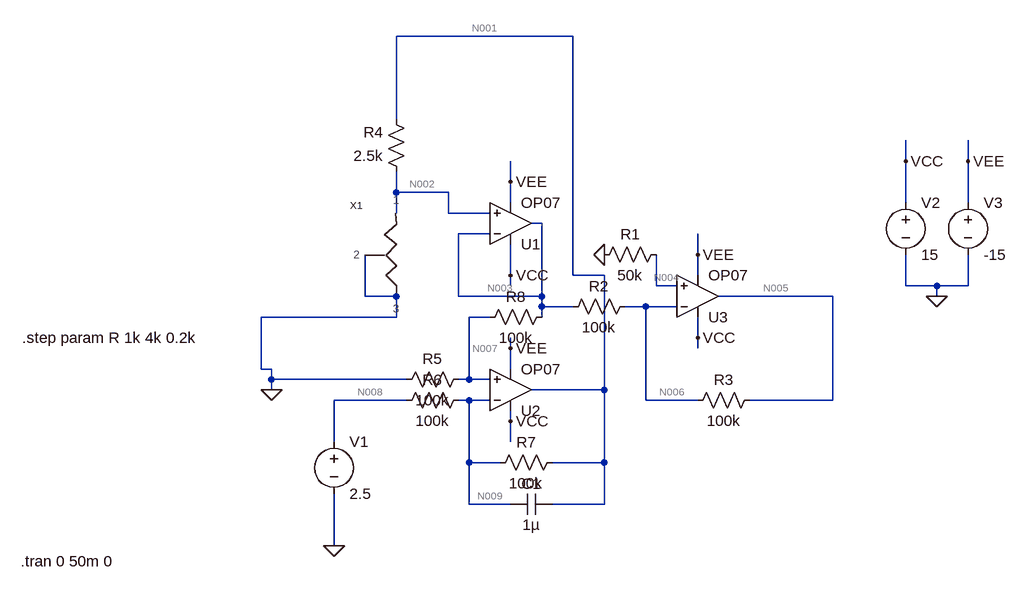
[diagram p0: schematic 2_23.asc]
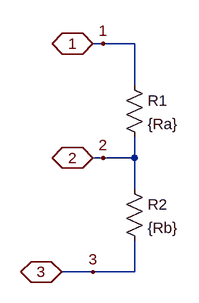
[diagram p1: sub-circuit dian_wei_qi.asc]
2_23.asc, the LTspice schematic file:
Version 4
SHEET 1 964 680
WIRE 288 -208 16 -208
WIRE 16 -80 16 -208
WIRE 800 -16 800 -48
WIRE 896 -16 896 -48
WIRE 192 16 192 -16
WIRE 16 32 16 0
WIRE 96 32 16 32
WIRE 192 48 192 16
WIRE 800 48 800 -16
WIRE 896 48 896 -16
WIRE 16 64 16 32
WIRE 96 64 96 32
WIRE 160 64 96 64
WIRE 240 80 224 80
WIRE 160 96 112 96
WIRE 480 128 480 96
WIRE 192 160 192 112
WIRE 288 160 288 -208
WIRE 336 160 288 160
WIRE 480 160 480 128
WIRE 192 176 192 160
WIRE 416 176 416 128
WIRE 448 176 416 176
WIRE 800 176 800 128
WIRE 848 176 800 176
WIRE 896 176 896 128
WIRE 896 176 848 176
WIRE -32 192 -32 128
WIRE 16 192 -32 192
WIRE 112 192 112 96
WIRE 240 192 240 80
WIRE 240 192 112 192
WIRE 688 192 512 192
WIRE 848 192 848 176
WIRE 240 208 240 192
WIRE 288 208 240 208
WIRE 400 208 368 208
WIRE 448 208 400 208
WIRE 16 224 16 192
WIRE 16 224 -192 224
WIRE 160 224 128 224
WIRE 240 224 240 208
WIRE 480 256 480 224
WIRE 192 272 192 256
WIRE 480 272 480 256
WIRE -192 304 -192 224
WIRE -176 304 -192 304
WIRE 192 304 192 272
WIRE -176 320 -176 304
WIRE 32 320 -176 320
WIRE 128 320 128 224
WIRE 128 320 112 320
WIRE 160 320 128 320
WIRE -176 336 -176 320
WIRE 336 336 336 160
WIRE 336 336 224 336
WIRE 32 352 -80 352
WIRE 128 352 112 352
WIRE 160 352 128 352
WIRE 400 352 400 208
WIRE 480 352 400 352
WIRE 688 352 688 192
WIRE 688 352 560 352
WIRE 192 384 192 368
WIRE -80 416 -80 352
WIRE 192 416 192 384
WIRE 128 448 128 352
WIRE 176 448 128 448
WIRE 336 448 336 336
WIRE 336 448 256 448
WIRE 128 512 128 448
WIRE 192 512 128 512
WIRE 336 512 336 448
WIRE 336 512 256 512
WIRE -80 576 -80 496
FLAG -176 336 0
FLAG -80 576 0
FLAG 336 128 0
FLAG 192 160 VCC
FLAG 192 384 VCC
FLAG 480 256 VCC
FLAG 480 128 VEE
FLAG 192 16 VEE
FLAG 192 272 VEE
FLAG 848 192 0
FLAG 800 -16 VCC
FLAG 896 -16 VEE
SYMBOL OpAmps\\OP07 192 144 M180
SYMATTR InstName U1
SYMBOL OpAmps\\OP07 192 400 M180
SYMATTR InstName U2
SYMBOL OpAmps\\OP07 480 256 M180
SYMATTR InstName U3
SYMBOL res 432 112 R90
WINDOW 0 0 56 VBottom 2
WINDOW 3 32 56 VTop 2
SYMATTR InstName R1
SYMATTR Value 50k
SYMBOL res 384 192 R90
WINDOW 0 0 56 VBottom 2
WINDOW 3 32 56 VTop 2
SYMATTR InstName R2
SYMATTR Value 100k
SYMBOL res 576 336 R90
WINDOW 0 0 56 VBottom 2
WINDOW 3 32 56 VTop 2
SYMATTR InstName R3
SYMATTR Value 100k
SYMBOL res 32 16 R180
WINDOW 0 36 76 Left 2
WINDOW 3 36 40 Left 2
SYMATTR InstName R4
SYMATTR Value 2.5k
SYMBOL dian_wei_qi 32 128 M0
SYMATTR InstName X1
SYMATTR SpiceLine Ra={R},Rb=10k
SYMBOL res 128 304 R90
WINDOW 0 0 56 VBottom 2
WINDOW 3 32 56 VTop 2
SYMATTR InstName R5
SYMATTR Value 100k
SYMBOL res 128 336 R90
WINDOW 0 0 56 VBottom 2
WINDOW 3 32 56 VTop 2
SYMATTR InstName R6
SYMATTR Value 100k
SYMBOL res 272 432 R90
WINDOW 0 0 56 VBottom 2
WINDOW 3 32 56 VTop 2
SYMATTR InstName R7
SYMATTR Value 100k
SYMBOL cap 256 496 R90
WINDOW 0 0 32 VBottom 2
WINDOW 3 32 32 VTop 2
SYMATTR InstName C1
SYMATTR Value 1µ
SYMBOL voltage -80 400 R0
WINDOW 123 0 0 Left 0
WINDOW 39 0 0 Left 0
SYMATTR InstName V1
SYMATTR Value 2.5
SYMBOL res 256 208 R90
WINDOW 0 0 56 VBottom 2
WINDOW 3 32 56 VTop 2
SYMATTR InstName R8
SYMATTR Value 100k
SYMBOL voltage 800 32 R0
WINDOW 123 0 0 Left 0
WINDOW 39 0 0 Left 0
SYMATTR InstName V2
SYMATTR Value 15
SYMBOL voltage 896 32 R0
WINDOW 123 0 0 Left 0
WINDOW 39 0 0 Left 0
SYMATTR InstName V3
SYMATTR Value -15
TEXT -560 256 Left 2 !.step param R 1k 4k 0.2k
TEXT -562 600 Left 2 !.tran 0 50m 0

dian_wei_qi.asc, the sub-circuit schematic file:
Version 4
SHEET 1 880 680
WIRE 144 -32 128 -32
WIRE 192 -32 144 -32
WIRE 192 32 192 -32
WIRE 144 144 128 144
WIRE 192 144 192 112
WIRE 192 144 144 144
WIRE 192 192 192 144
WIRE 128 320 80 320
WIRE 192 320 192 272
WIRE 192 320 128 320
FLAG 144 -32 1
FLAG 144 144 2
FLAG 128 320 3
FLAG 128 -32 1
IOPIN 128 -32 BiDir
FLAG 128 144 2
IOPIN 128 144 BiDir
FLAG 80 320 3
IOPIN 80 320 BiDir
SYMBOL res 176 16 R0
SYMATTR InstName R1
SYMATTR Value {Ra}
SYMBOL res 176 176 R0
SYMATTR InstName R2
SYMATTR Value {Rb}

The netlist it stands for:
* 2_23.asc
XU1 N002 N003 VCC VEE N003 LT1001  ; OP07, pins In+ In- V+ V- OUT
XU2 N007 N009 VCC VEE N001 LT1001  ; OP07, pins In+ In- V+ V- OUT
XU3 N004 N006 VCC VEE N005 LT1001  ; OP07, pins In+ In- V+ V- OUT
R1 N004 0 50k
R2 N006 N003 100k
R3 N005 N006 100k
R4 N002 N001 2.5k
XX1 N002 0 0 dian_wei_qi params: Ra={R},Rb=10k
R5 N007 0 100k
R6 N009 N008 100k
R7 N001 N009 100k
C1 N001 N009 1µ
V1 N008 0 2.5
R8 N003 N007 100k
V2 VCC 0 15
V3 VEE 0 -15

* block symbol definitions
.subckt dian_wei_qi 1 2 3
R1 1 2 {Ra}
R2 2 3 {Rb}
.ends dian_wei_qi

.step param R 1k 4k 0.2k
.tran 0 50m 0
.lib LTC.lib
.backanno
.end

* Results of the author's LTspice run, read from the files saved beside the schematic
* Operating Point (first step), zero values left out:
*   r = 1 k
*   V(n003) = -1 V
*   V(n002) = -1 V
*   V(vcc) = 15 V
*   V(vee) = -15 V
*   V(n009) = -500 mV
*   V(n007) = -500 mV
*   V(n001) = -3.5 V
*   V(n006) = -1.341 µV
*   V(n005) = 1 V
*   V(n008) = 2.5 V
*   I(R8) = -5 µA
*   I(R7) = -30 µA
*   I(R6) = -30 µA
*   I(R5) = -5 µA
*   I(R4) = 1 mA
*   I(R3) = 10 µA
*   I(R2) = 10 µA
*   I(V3) = 7.297 mA
*   I(V2) = -6.262 mA
*   I(V1) = -30 µA
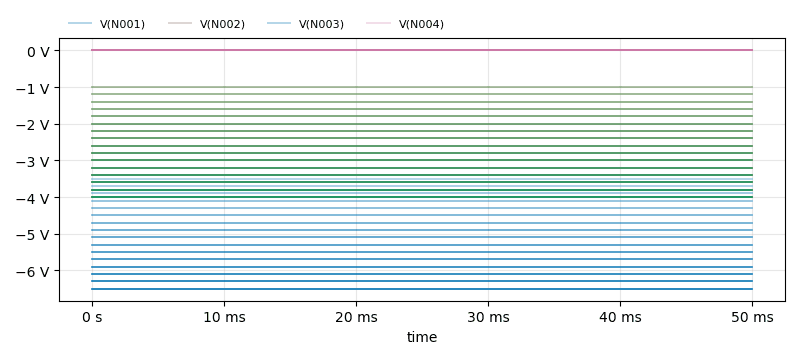
[diagram p2: Transient Analysis of 2_23.asc, plotted from the saved traces]
* Transient Analysis, 16 runs:
*   V(N001) [r=1000]: min -3.5 V, max -3.5 V, average -3.5 V, rms 3.5 V, last -3.5 V
*   V(N001) [r=1200]: min -3.7 V, max -3.7 V, average -3.7 V, rms 3.7 V, last -3.7 V
*   V(N001) [r=1400]: min -3.9 V, max -3.9 V, average -3.9 V, rms 3.9 V, last -3.9 V
*   V(N001) [r=1600]: min -4.1 V, max -4.1 V, average -4.1 V, rms 4.1 V, last -4.1 V
*   V(N001) [r=1800]: min -4.3 V, max -4.3 V, average -4.3 V, rms 4.3 V, last -4.3 V
*   V(N001) [r=2000]: min -4.5 V, max -4.5 V, average -4.5 V, rms 4.5 V, last -4.5 V
*   V(N001) [r=2200]: min -4.7 V, max -4.7 V, average -4.7 V, rms 4.7 V, last -4.7 V
*   V(N001) [r=2400]: min -4.9 V, max -4.9 V, average -4.9 V, rms 4.9 V, last -4.9 V
*   V(N002) [r=1000]: min -1 V, max -1 V, average -1 V, rms 1 V, last -1 V
*   V(N002) [r=1200]: min -1.2 V, max -1.2 V, average -1.2 V, rms 1.2 V, last -1.2 V
*   V(N002) [r=1400]: min -1.4 V, max -1.4 V, average -1.4 V, rms 1.4 V, last -1.4 V
*   V(N002) [r=1600]: min -1.6 V, max -1.6 V, average -1.6 V, rms 1.6 V, last -1.6 V
*   V(N002) [r=1800]: min -1.8 V, max -1.8 V, average -1.8 V, rms 1.8 V, last -1.8 V
*   V(N002) [r=2000]: min -2 V, max -2 V, average -2 V, rms 2 V, last -2 V
*   V(N002) [r=2200]: min -2.2 V, max -2.2 V, average -2.2 V, rms 2.2 V, last -2.2 V
*   V(N002) [r=2400]: min -2.4 V, max -2.4 V, average -2.4 V, rms 2.4 V, last -2.4 V
*   V(N003) [r=1000]: min -1 V, max -1 V, average -1 V, rms 1 V, last -1 V
*   V(N003) [r=1200]: min -1.2 V, max -1.2 V, average -1.2 V, rms 1.2 V, last -1.2 V
*   V(N003) [r=1400]: min -1.4 V, max -1.4 V, average -1.4 V, rms 1.4 V, last -1.4 V
*   V(N003) [r=1600]: min -1.6 V, max -1.6 V, average -1.6 V, rms 1.6 V, last -1.6 V
*   V(N003) [r=1800]: min -1.8 V, max -1.8 V, average -1.8 V, rms 1.8 V, last -1.8 V
*   V(N003) [r=2000]: min -2 V, max -2 V, average -2 V, rms 2 V, last -2 V
*   V(N003) [r=2200]: min -2.2 V, max -2.2 V, average -2.2 V, rms 2.2 V, last -2.2 V
*   V(N003) [r=2400]: min -2.4 V, max -2.4 V, average -2.4 V, rms 2.4 V, last -2.4 V
*   V(N004) [r=1000]: min -904.7 pV, max -904.7 pV, average -904.7 pV, rms 904.7 pV, last -904.7 pV
*   V(N004) [r=1200]: min -1.086 nV, max -1.086 nV, average -1.086 nV, rms 1.086 nV, last -1.086 nV
*   V(N004) [r=1400]: min -1.267 nV, max -1.267 nV, average -1.267 nV, rms 1.267 nV, last -1.267 nV
*   V(N004) [r=1600]: min -1.448 nV, max -1.448 nV, average -1.448 nV, rms 1.448 nV, last -1.448 nV
*   V(N004) [r=1800]: min -1.628 nV, max -1.628 nV, average -1.628 nV, rms 1.628 nV, last -1.628 nV
*   V(N004) [r=2000]: min -1.809 nV, max -1.809 nV, average -1.809 nV, rms 1.809 nV, last -1.809 nV
*   V(N004) [r=2200]: min -1.99 nV, max -1.99 nV, average -1.99 nV, rms 1.99 nV, last -1.99 nV
*   V(N004) [r=2400]: min -2.171 nV, max -2.171 nV, average -2.171 nV, rms 2.171 nV, last -2.171 nV